# Altium schematic sheet [06] - POWER.SchDoc
size A3; DocumentNumber: 6; SheetNumber: 6; SheetTotal: 8
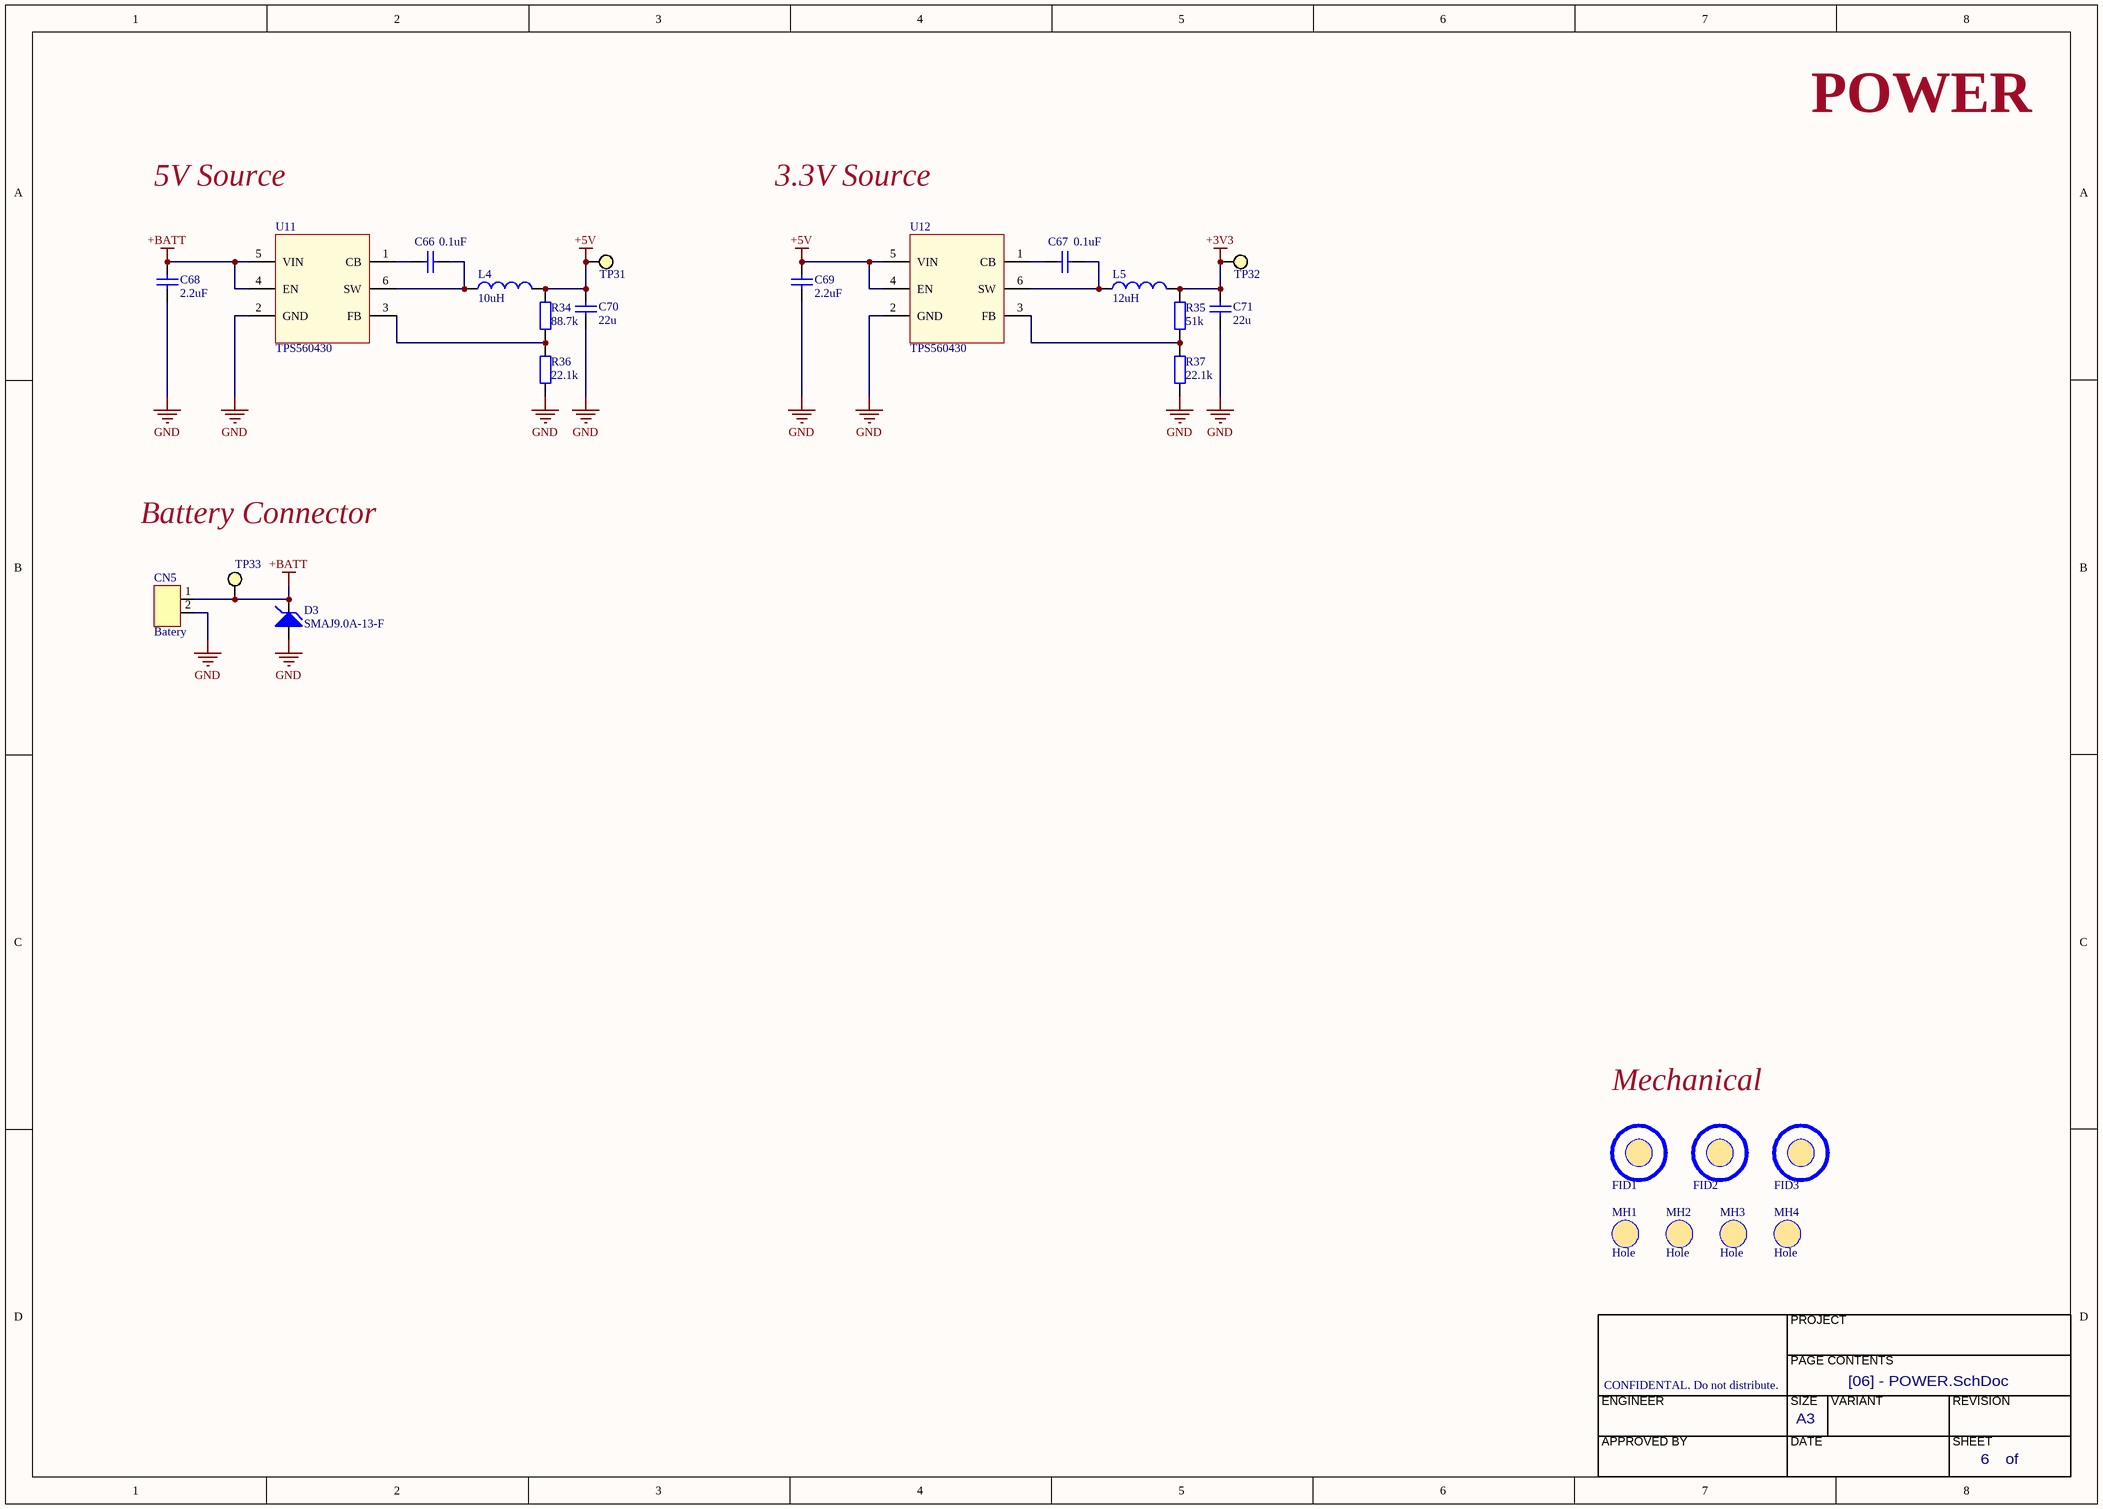
[diagram p0: [06] - POWER.SchDoc]

## Parts
C66  0.1uF  [CAP0402]
C67  0.1uF  [CAP0402]
C68  2.2uF  [CAP0402]
C69  2.2uF  [CAP0402]
C70  22u  [CAP0402]
C71  22u  [CAP0402]
CN5  Batery  [H-D-1x2]
D3  SMAJ9.0A-13-F  [SMB]
FID1  Fiducial  [Fiducial]  (value not drawn)  (no BOM)
FID2  Fiducial  [Fiducial]  (value not drawn)  (no BOM)
FID3  Fiducial  [Fiducial]  (value not drawn)  (no BOM)
L4  10uH  [INDC0603-0201]
L5  12uH  [INDC0603-0201]
MH1  Hole  (no BOM)
MH2  Hole  (no BOM)
MH3  Hole  (no BOM)
MH4  Hole  (no BOM)
R34  88.7k  [RES0402]
R35  51k  [RES0402]
R36  22.1k  [RES0402]
R37  22.1k  [RES0402]
TP31  TestPoint  [TestPoint]  (value not drawn)  (no BOM)
TP32  TestPoint  [TestPoint]  (value not drawn)  (no BOM)
TP33  TestPoint  [TestPoint]  (value not drawn)  (no BOM)
U11  TPS560430
U12  TPS560430

## Nets
+3V3: C71.1 L5.2 R35.1 TP32.1
+5V: C69.2 C70.1 L4.2 R34.1 TP31.1 U12.4(EN) U12.5(VIN)
+BATT: C68.2 CN5.1 D3.C TP33.1 U11.4(EN) U11.5(VIN)
GND: C68.1 C69.1 C70.2 C71.2 CN5.2 D3.A R36.1 R37.1 U11.2(GND) U12.2(GND)
NetC66_1: C66.1 L4.1 U11.6(SW)
NetC66_2: C66.2 U11.1(CB)
NetC67_1: C67.1 L5.1 U12.6(SW)
NetC67_2: C67.2 U12.1(CB)
NetR34_2: R34.2 R36.2 U11.3(FB)
NetR35_2: R35.2 R37.2 U12.3(FB)

## Notes on the sheet
- POWER
- 5V Source
- 3.3V Source
- Battery Connector
- Mechanical
- PROJECT
- CONFIDENTAL. Do not distribute.
- PAGE CONTENTS
- ENGINEER
- APPROVED BY
- SIZE
- DATE
- A3
- VARIANT
- REVISION
- SHEET
- of

## Library data of the parts
C66-C71 = Cap: Capacitor; Manufacturer: *; Manufacturer Part Number: *; Supplier 1: Digi-Key; Supplier Part Number 1: *
CN5 = CONN-1x2pin: Connector 1x2; Manufacturer: *; Manufacturer Part Number: *; Supplier 1: Digi-Key; Supplier Part Number 1: *
D3 = Diode_TVS_Uni: TVS DIODE
L4 L5 = Inductor: DigiKey: *
R34-R37 = Res: Resistor; Manufacturer: *; Manufacturer Part Number: *; Supplier 1: Digi-Key; Supplier Part Number 1: *